# EAGLE schematic untitled (EAGLE 9.6.0)
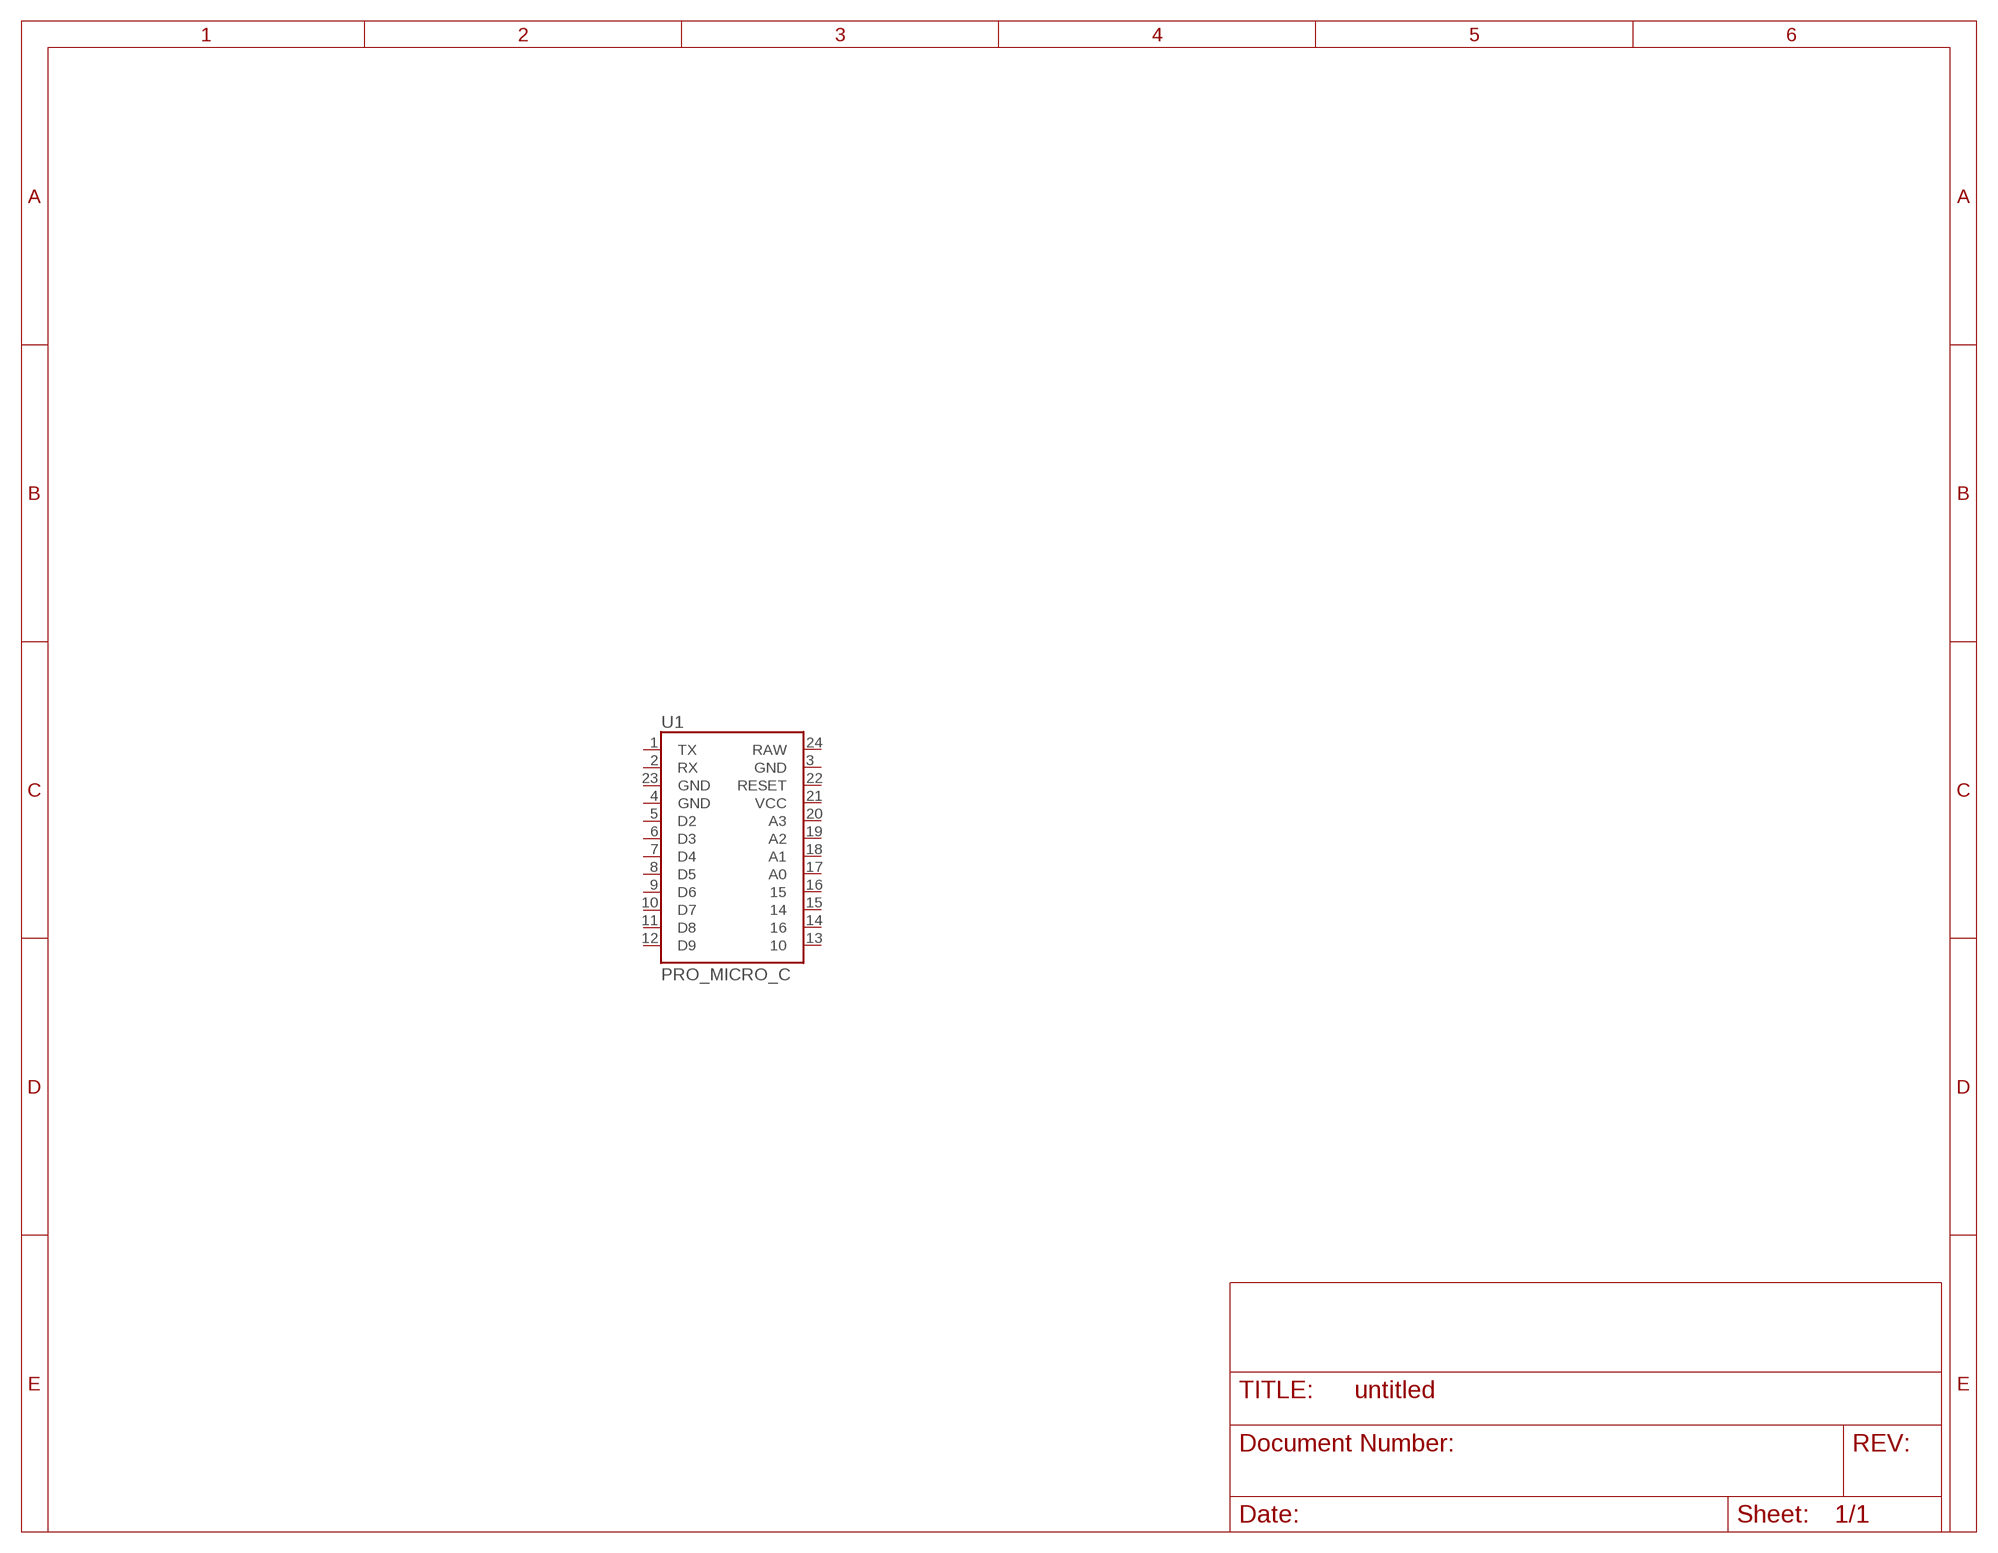
[diagram p0: schematic, sheet 1]

## Parts
U1  PRO_MICRO_C  [PRO_MICRO_C]
Unconnected: U1.1(TX) U1.2(RX) U1.3(GND) U1.4(GND) U1.5(D2) U1.6(D3) U1.7(D4) U1.8(D5) U1.9(D6) U1.10(D7) U1.11(D8) U1.12(D9) U1.13 U1.14 U1.15 U1.16 U1.17(A0) U1.18(A1) U1.19(A2) U1.20(A3) U1.21(VCC) U1.22(RESET) U1.23(GND) U1.24(RAW)

## Library data of the parts
U1 = SparkFun-Boards:PRO_MICRO_C